# Altium schematic sheet 02_MCU_IO.SchDoc: =GlobalProjectName
size 594 x 420 mm; CheckedBy: A_D; Author: A_D; SheetNumber: 2; SheetTotal: 3; PageSetup: Record=PageOptions|CenterHorizontal=True|CenterVertical=True|PrintScale=0.70|XCorrection=1.00|YCorrection=1.00|PrintKind=2|BorderSize=5000000|LeftOffset=9000|BottomOffset=10100|Orientation=2|PaperLength=11176|PaperWidth=8636|Scale=100|PaperSource=259|PrintQuality=-3|MediaType=1|DitherType=10|PrintScaleMode=1|PaperKind=A3|PaperIndex=8
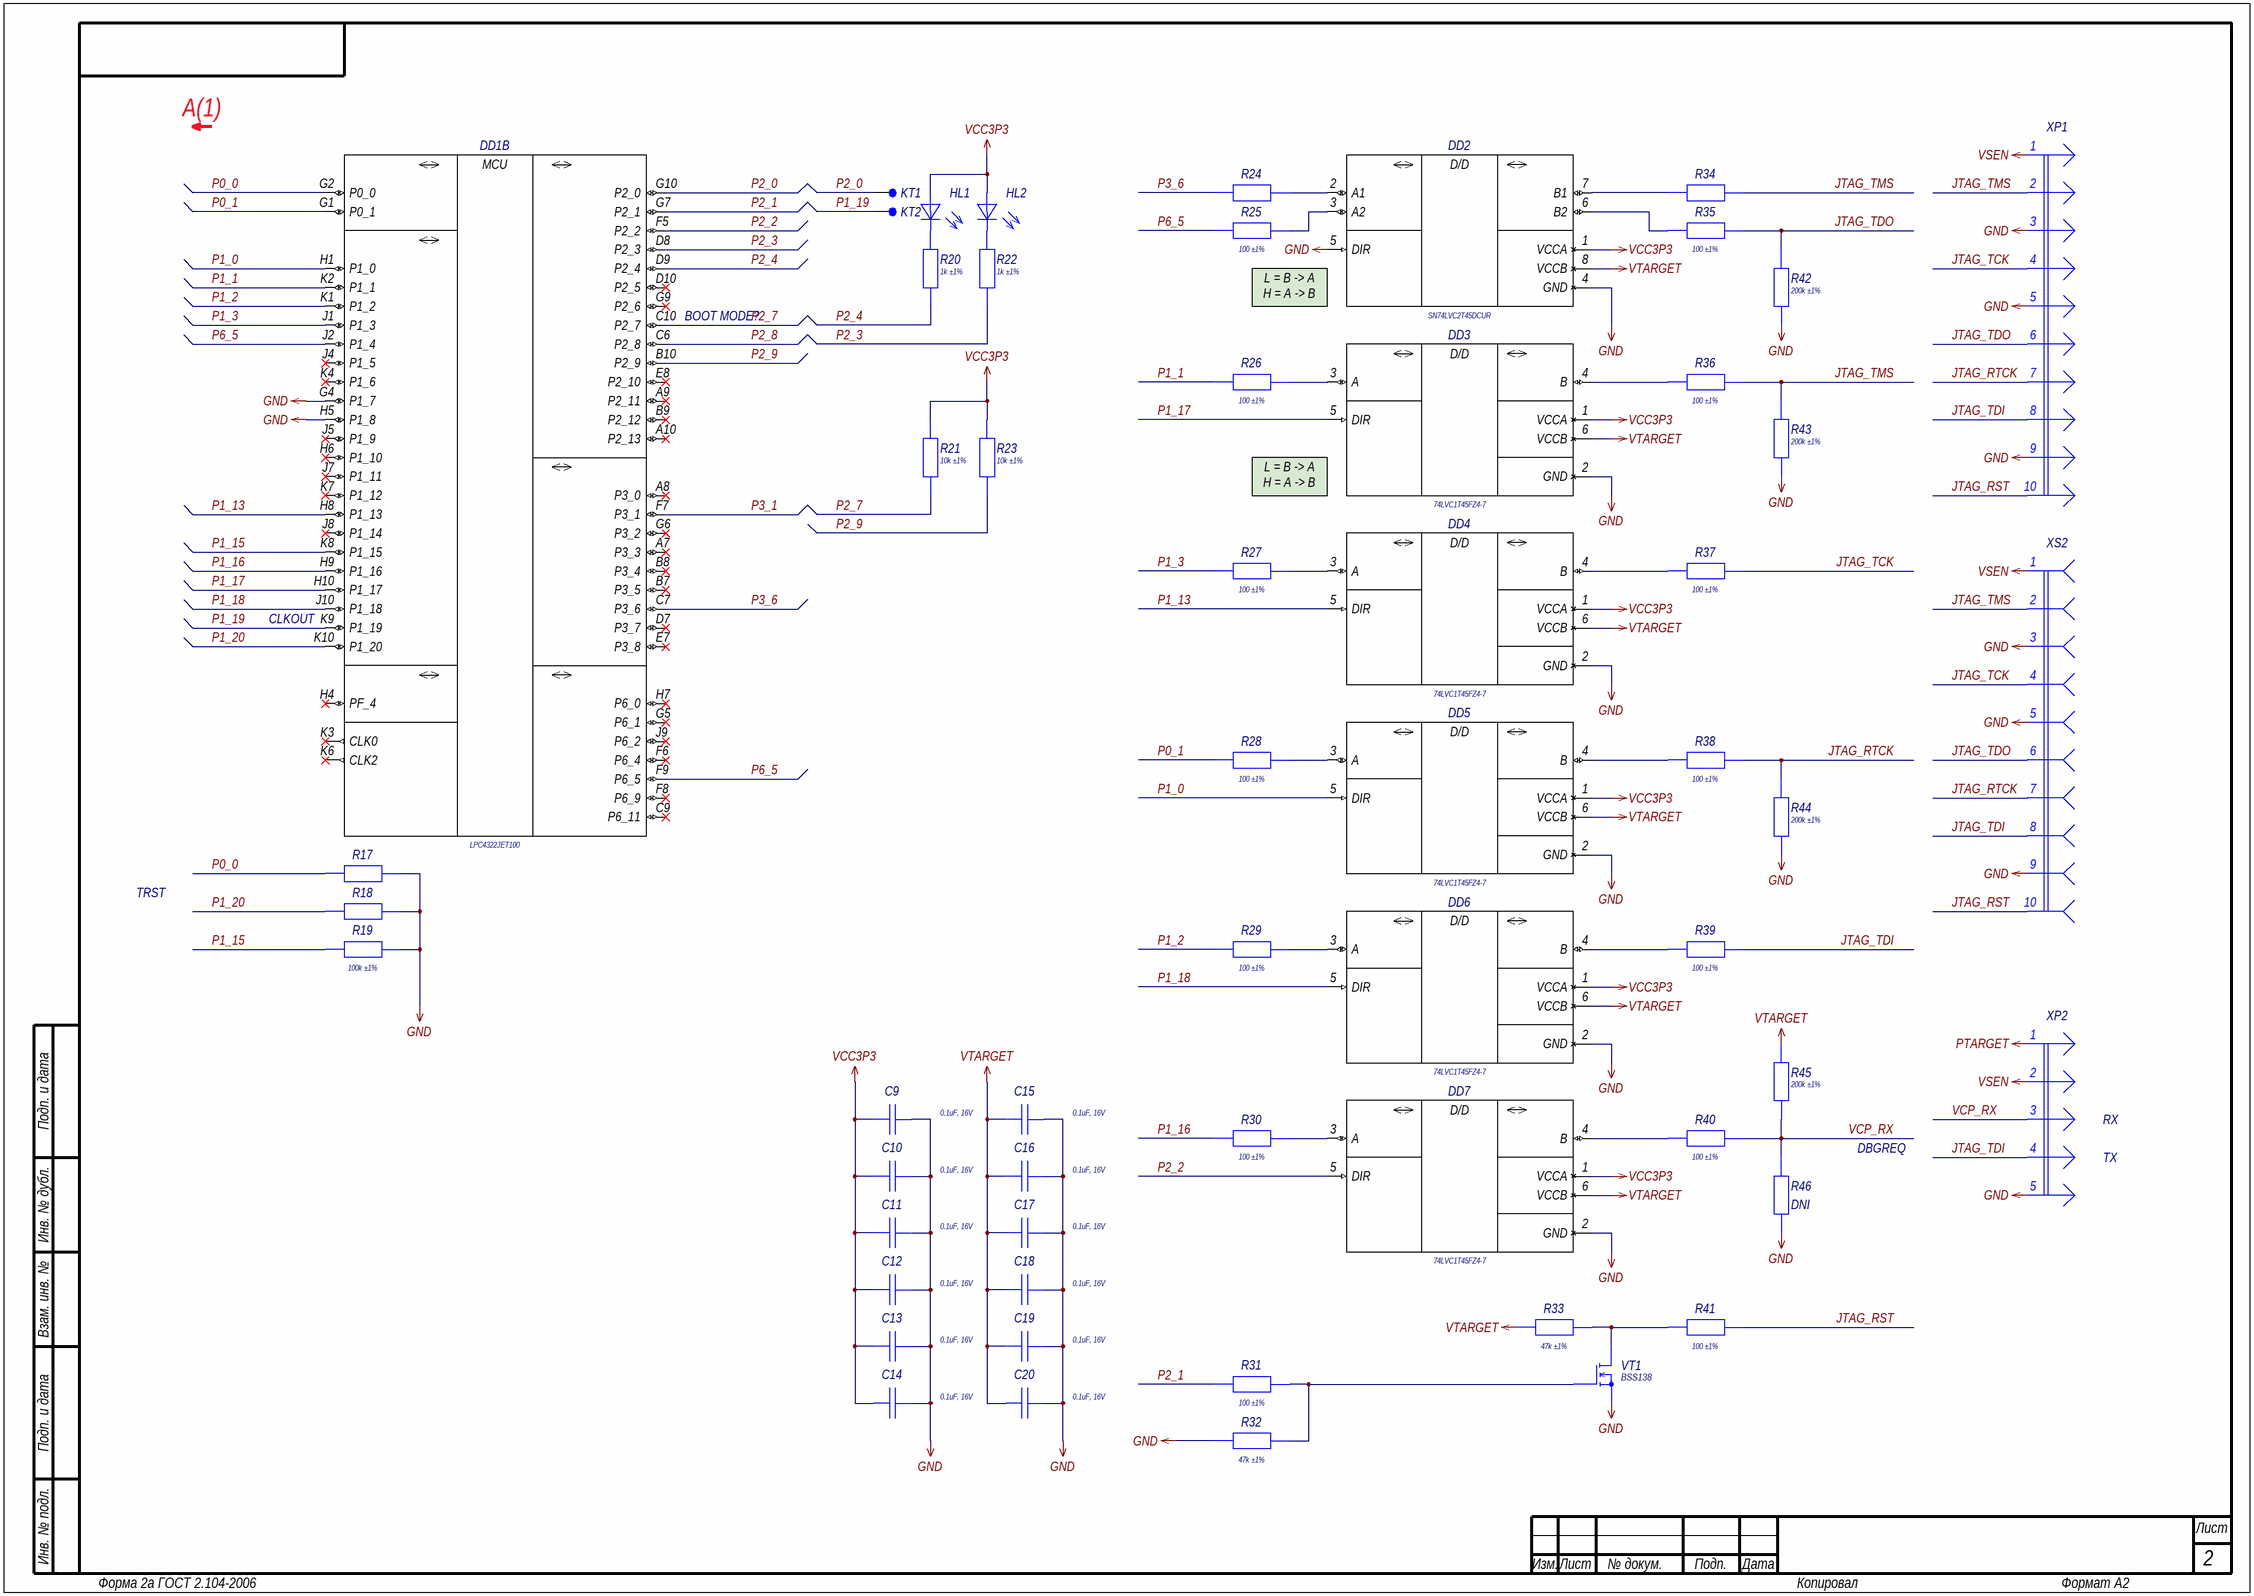
[diagram p0: 02_MCU_IO.SchDoc]

## Parts
C9  Schematic Value: 0.1uF, 16V  [C0402_100X050H050_H]  (hidden comment: Capacitor)
C10  Schematic Value: 0.1uF, 16V  [C0402_100X050H050_H]  (hidden comment: Capacitor)
C11  Schematic Value: 0.1uF, 16V  [C0402_100X050H050_H]  (hidden comment: Capacitor)
C12  Schematic Value: 0.1uF, 16V  [C0402_100X050H050_H]  (hidden comment: Capacitor)
C13  Schematic Value: 0.1uF, 16V  [C0402_100X050H050_H]  (hidden comment: Capacitor)
C14  Schematic Value: 0.1uF, 16V  [C0402_100X050H050_H]  (hidden comment: Capacitor)
C15  Schematic Value: 0.1uF, 16V  [C0402_100X050H050_H]  (hidden comment: Capacitor)
C16  Schematic Value: 0.1uF, 16V  [C0402_100X050H050_H]  (hidden comment: Capacitor)
C17  Schematic Value: 0.1uF, 16V  [C0402_100X050H050_H]  (hidden comment: Capacitor)
C18  Schematic Value: 0.1uF, 16V  [C0402_100X050H050_H]  (hidden comment: Capacitor)
C19  Schematic Value: 0.1uF, 16V  [C0402_100X050H050_H]  (hidden comment: Capacitor)
C20  Schematic Value: 0.1uF, 16V  [C0402_100X050H050_H]  (hidden comment: Capacitor)
DD1  Schematic Value: LPC4322JET100  [TFBGA-100_080P900X900X120_N]  (hidden comment: LPC43xxJET100-Series)  (part B of 3)
DD2  Schematic Value: SN74LVC2T45DCUR  [VSSOP-8_050P200X230X090_N]  (hidden comment: SN74LVC2T45DCx-Series)
DD3  Schematic Value: 74LVC1T45FZ4-7  [X2-DFN-6_050P140X100X040_N]  (hidden comment: 74LVC1T45x-Series)
DD4  Schematic Value: 74LVC1T45FZ4-7  [X2-DFN-6_050P140X100X040_N]  (hidden comment: 74LVC1T45x-Series)
DD5  Schematic Value: 74LVC1T45FZ4-7  [X2-DFN-6_050P140X100X040_N]  (hidden comment: 74LVC1T45x-Series)
DD6  Schematic Value: 74LVC1T45FZ4-7  [X2-DFN-6_050P140X100X040_N]  (hidden comment: 74LVC1T45x-Series)
DD7  Schematic Value: 74LVC1T45FZ4-7  [X2-DFN-6_050P140X100X040_N]  (hidden comment: 74LVC1T45x-Series)
HL1  Text  [LD0603_L]  (value not drawn)
HL2  Text  [LD0603_L]  (value not drawn)
KT1  Text  [TP-SMT-C-0.5mm]  (value not drawn)  (no BOM)
KT2  Text  [TP-SMT-C-0.5mm]  (value not drawn)  (no BOM)
R17  Resistor  [R0402_100X050H035_H]  (value not drawn)
R18  Resistor  [R0402_100X050H035_H]  (value not drawn)
R19  Schematic Value: 100k ±1%  [R0402_100X050H035_H]  (hidden comment: Resistor)
R20  Schematic Value: 1k ±1%  [R0402_100X050H035_H]  (hidden comment: Resistor)
R21  Schematic Value: 10k ±1%  [R0402_100X050H035_H]  (hidden comment: Resistor)
R22  Schematic Value: 1k ±1%  [R0402_100X050H035_H]  (hidden comment: Resistor)
R23  Schematic Value: 10k ±1%  [R0402_100X050H035_H]  (hidden comment: Resistor)
R24  Resistor  [R0402_100X050H035_H]  (value not drawn)
R25  Schematic Value: 100 ±1%  [R0402_100X050H035_H]  (hidden comment: Resistor)
R26  Schematic Value: 100 ±1%  [R0402_100X050H035_H]  (hidden comment: Resistor)
R27  Schematic Value: 100 ±1%  [R0402_100X050H035_H]  (hidden comment: Resistor)
R28  Schematic Value: 100 ±1%  [R0402_100X050H035_H]  (hidden comment: Resistor)
R29  Schematic Value: 100 ±1%  [R0402_100X050H035_H]  (hidden comment: Resistor)
R30  Schematic Value: 100 ±1%  [R0402_100X050H035_H]  (hidden comment: Resistor)
R31  Schematic Value: 100 ±1%  [R0402_100X050H035_H]  (hidden comment: Resistor)
R32  Schematic Value: 47k ±1%  [R0402_100X050H035_H]  (hidden comment: Resistor)
R33  Schematic Value: 47k ±1%  [R0402_100X050H035_H]  (hidden comment: Resistor)
R34  Resistor  [R0402_100X050H035_H]  (value not drawn)
R35  Schematic Value: 100 ±1%  [R0402_100X050H035_H]  (hidden comment: Resistor)
R36  Schematic Value: 100 ±1%  [R0402_100X050H035_H]  (hidden comment: Resistor)
R37  Schematic Value: 100 ±1%  [R0402_100X050H035_H]  (hidden comment: Resistor)
R38  Schematic Value: 100 ±1%  [R0402_100X050H035_H]  (hidden comment: Resistor)
R39  Schematic Value: 100 ±1%  [R0402_100X050H035_H]  (hidden comment: Resistor)
R40  Schematic Value: 100 ±1%  [R0402_100X050H035_H]  (hidden comment: Resistor)
R41  Schematic Value: 100 ±1%  [R0402_100X050H035_H]  (hidden comment: Resistor)
R42  Schematic Value: 200k ±1%  [R0402_100X050H035_H]  (hidden comment: Resistor)
R43  Schematic Value: 200k ±1%  [R0402_100X050H035_H]  (hidden comment: Resistor)
R44  Schematic Value: 200k ±1%  [R0402_100X050H035_H]  (hidden comment: Resistor)
R45  Schematic Value: 200k ±1%  [R0402_100X050H035_H]  (hidden comment: Resistor)
R46  Resistor  [R0402_100X050H035_H]  (value not drawn)  (no BOM)
VT1  Schematic Value: BSS138  [SOT-23_190P290X160X145_N]  (hidden comment: MOSFET-N_32)
XP1  Text  [IDC-10MR]  (value not drawn)
XP2  Text  [PLS-5RR]  (value not drawn)
XS2  Text  [XF2M-1015-1A]  (value not drawn)

## Nets
GND: C9.1 C10.1 C11.1 C12.1 C13.1 C14.1 C15.1 C16.1 C17.1 C18.1 C19.1 C20.1 DD1.G4(P1_7) DD1.H5(P1_8) DD2.4(GND) DD2.5(DIR) DD3.2(GND) DD4.2(GND) DD5.2(GND) DD6.2(GND) DD7.2(GND) R17.2 R18.2 R19.2 R32.2 R42.1 R43.1 R44.1 R46.1 VT1.2(S) XP1.3 XP1.5 XP1.9 XP2.5 XS2.3 XS2.5 XS2.9
PTARGET: XP2.1
VCC3P3: C9.2 C10.2 C11.2 C12.2 C13.2 C14.2 DD2.1(VCCA) DD3.1(VCCA) DD4.1(VCCA) DD5.1(VCCA) DD6.1(VCCA) DD7.1(VCCA) HL1.1 HL2.1 R21.1 R23.1
VSEN: XP1.1 XP2.2 XS2.1
VTARGET: C15.2 C16.2 C17.2 C18.2 C19.2 C20.2 DD2.8(VCCB) DD3.6(VCCB) DD4.6(VCCB) DD5.6(VCCB) DD6.6(VCCB) DD7.6(VCCB) R33.2 R45.2
JTAG_RST: R41.2 XP1.10 XS2.10
JTAG_RTCK: R38.2 R44.2 XP1.7 XS2.7
JTAG_TCK: R37.2 XP1.4 XS2.4
JTAG_TDI: R39.2 XP1.8 XP2.4 XS2.8
JTAG_TDO: R35.2 R42.2 XP1.6 XS2.6
JTAG_TMS: R34.2 R36.2 R43.2 XP1.2 XS2.2
P0_0: DD1.G2(P0_0) R17.1
P0_1: DD1.G1(P0_1) R28.1
P1_0: DD1.H1(P1_0) DD5.5(DIR)
P1_1: DD1.K2(P1_1) R26.1
P1_2: DD1.K1(P1_2) R29.1
P1_3: DD1.J1(P1_3) R27.1
P1_13: DD1.H8(P1_13) DD4.5(DIR)
P1_15: DD1.K8(P1_15) R19.1
P1_16: DD1.H9(P1_16) R30.1
P1_17: DD1.H10(P1_17) DD3.5(DIR)
P1_18: DD1.J10(P1_18) DD6.5(DIR)
P1_19: DD1.K9(P1_19) KT2.1
P1_20: DD1.K10(P1_20) R18.1
P2_0: DD1.G10(P2_0) KT1.1
P2_1: DD1.G7(P2_1) R31.1
P2_2: DD1.F5(P2_2) DD7.5(DIR)
P2_3: DD1.D8(P2_3) R22.1
P2_4: DD1.D9(P2_4) R20.1
P2_7: DD1.C10(P2_7) R21.2
P2_8: DD1.C6(P2_8)
P2_9: DD1.B10(P2_9) R23.2
P3_1: DD1.F7(P3_1)
P3_6: DD1.C7(P3_6) R24.1
P6_5: DD1.F9(P6_5) DD1.J2(P1_4) R25.1
VCP_RX: R40.2 R45.1 R46.2 XP2.3
NetDD2_2: DD2.2(A1) R24.2
NetDD2_3: DD2.3(A2) R25.2
NetDD2_6: DD2.6(B2) R35.1
NetDD2_7: DD2.7(B1) R34.1
NetDD3_3: DD3.3(A) R26.2
NetDD3_4: DD3.4(B) R36.1
NetDD4_3: DD4.3(A) R27.2
NetDD4_4: DD4.4(B) R37.1
NetDD5_3: DD5.3(A) R28.2
NetDD5_4: DD5.4(B) R38.1
NetDD6_3: DD6.3(A) R29.2
NetDD6_4: DD6.4(B) R39.1
NetDD7_3: DD7.3(A) R30.2
NetDD7_4: DD7.4(B) R40.1
NetHL1_2: HL1.2 R20.2
NetHL2_2: HL2.2 R22.2
NetR31_2: R31.2 R32.1 VT1.1(G)
NetR33_1: R33.1 R41.1 VT1.3(D)

Not connected (* = marked no-connect by the designer): DD1 A7(P3_3)* A8(P3_0)* A9(P2_11)* A10(P2_13)* B7(P3_5)* B8(P3_4)* B9(P2_12)* C9(P6_11)* D7(P3_7)* D10(P2_5)* E7(P3_8)* E8(P2_10)* F6(P6_4)* F8(P6_9)* G5(P6_1)* G6(P3_2)* G9(P2_6)* H4(PF_4)* H6(P1_10)* H7(P6_0)* J4(P1_5)* J5(P1_9)* J7(P1_11)* J8(P1_14)* J9(P6_2)* K3(CLK0)* K4(P1_6)* K6(CLK2)* K7(P1_12)*

## Notes on the sheet
- А(1)
- (near DD2) L = B -> A
  H = A -> B
- (near DD1) BOOT MODE?
- (near DD3) L = B -> A
  H = A -> B
- (near DD1) CLKOUT
- TRST
- RX
- DBGREQ
- TX
- (near R46) DNI
- Подп. и дата
- Инв. № дубл.
- Взам. инв. №
- Инв. № подл.
- Изм.
- Лист
- № докум.
- Подп.
- Дата
- Форма 2а ГОСТ 2.104-2006
- Копировал
- Формат А2
- (in symbol 74LVC1T45FZ4-7) D/D
- (in symbol LPC4322JET100, part B) MCU
- (in symbol SN74LVC2T45DCUR) D/D

## Library data of the parts
C9-C20 = GCM155R71C104KA55D: Manufacturer: Murata; ID: 163; Value: 0.1uF; Voltage: 16V; Tolerance: ±10%; Dielectric Type: X7R; Functional Analog: GRM155R71C104KA88D, GCM155R71C104KA55J, GCM155R71C104KA55W; AEC Standard: AEC-Q200; Part Number: GCM155R71C104KA55D; Footprint: 0402; LCSC Part: C85857; Temperature Min: -55°С; Temperature Max: +125°С; Part Type: Конденсатор
DD1 = LPC4322JET100: Manufacturer: NXP Semiconductors; ID: 45; Supply Operation: +2.4…3.6V; Prog Interface: JTAG, SWD, USB; Operation Frequency: 204MHz; ROM: 512K; RAM: 104K; IO Lines: 49; Part Number: LPC4322JET100; Value: LPC4322JET100; Temperature Min: -40°С; Temperature Max: +105°С
DD2 = SN74LVC2T45DCUR: Manufacturer: Texas Instruments; ID: 18; Supply 1 Operation: +1,65…5,5V; Supply Current: 10uA; Directional: Unidirection; Channels: 2; Max Data Rate: 420Mbps; Functional Analog: 74LVCH2T45DC,125; Part Number: SN74LVC2T45DCUR; Value: SN74LVC2T45DCUR; Supply 2 Operation: +1,65…5,5V; LCSC Part: C15741; Temperature Min: -40°С; Temperature Max: +85°С; Part Type: Микросхема
DD3-DD7 = 74LVC1T45FZ4-7: Manufacturer: Diodes Incorporated; ID: 13; Supply 1 Operation: +1.65…5.5V; Supply Current: 3uA; Directional: Bidirection; Channels: 1; Prop Delay: 15.1nS; Part Number: 74LVC1T45FZ4-7; Value: 74LVC1T45FZ4-7; Supply 2 Operation: +1.65…5.5V; LCSC Part: C150482; Temperature Min: -40°С; Temperature Max: +150°С; Part Type: Микросхема
HL1 = NCD0603R1: Manufacturer: Foshan NationStar Optoelectronics; Type: Индикатор единичный; ID: 42; Forward Voltage: 2.0V; Forward Current: 25mA; Power Dissipation: 65mW; Luminous Flux: 120; Color: Red; Leds: 1; Published: 03.12.2013; Publisher: Andrew Danich; Part Number: NCD0603R1; Value: NCD0603R1; Footprint: 0603; LCSC Part: C84263; Temperature Min: -30°С; Temperature Max: +85°С; Schematic Value: NCD0603R1
HL2 = NCD0603G1: Manufacturer: Foshan NationStar Optoelectronics; Type: Индикатор единичный; ID: 45; Forward Voltage: 3.0V; Forward Current: 20mA; Power Dissipation: 72mW; Luminous Flux: 650; Color: Green; Leds: 1; Published: 03.12.2013; Publisher: Andrew Danich; Part Number: NCD0603G1; Value: NCD0603G1; Footprint: 0603; LCSC Part: C84267; Temperature Min: -30°С; Temperature Max: +85°С; Schematic Value: NCD0603G1
KT1 KT2 = TestPoint-SMT: ID: 6; Application Type: On PCB Test Point; Published: 03.03.2015; Publisher: Andrew Danich; Part Number: TestPoint-SMT; Value: TestPoint-SMT; Schematic Value: TestPoint-SMT
R17 R18 = 0402WGF1003TCE: Manufacturer: Uniroyal Elec; ID: 661; Value: 100k; Limit Voltage: 50V; Tolerance: ±1%; Temperature Coefficient: 100ppm; Total Power Dissipation: 0.1W; Series Type: Thick-Film; Schematic Value: 100k ±1%; Part Number: 0402WGF1003TCE; Footprint: 0402; Temperature Min: -55°С; Temperature Max: +155°С; Part Type: Резистор; LCSC Part: C25741
R19 = 0402WGF1003TCE: Manufacturer: Uniroyal Elec; ID: 661; Value: 100k; Limit Voltage: 50V; Tolerance: ±1%; Temperature Coefficient: 100ppm; Total Power Dissipation: 0.1W; Series Type: Thick-Film; Part Number: 0402WGF1003TCE; Footprint: 0402; Temperature Min: -55°С; Temperature Max: +155°С; Part Type: Резистор; LCSC Part: C25741
R20 R22 = 0402WGF1001TCE: Manufacturer: Uniroyal Elec; ID: 663; Value: 1k; Limit Voltage: 50V; Tolerance: ±1%; Temperature Coefficient: 100ppm; Total Power Dissipation: 0.1W; Series Type: Thick-Film; Part Number: 0402WGF1001TCE; Footprint: 0402; Temperature Min: -55°С; Temperature Max: +155°С; Part Type: Резистор; LCSC Part: C11702
R21 R23 = 0402WGF1002TCE: Manufacturer: Uniroyal Elec; ID: 665; Value: 10k; Limit Voltage: 50V; Tolerance: ±1%; Temperature Coefficient: 100ppm; Total Power Dissipation: 0.1W; Series Type: Thick-Film; Part Number: 0402WGF1002TCE; Footprint: 0402; Temperature Min: -55°С; Temperature Max: +155°С; Part Type: Резистор; LCSC Part: C25744
R24 R34 = RC0402FR-07100RL: Manufacturer: Yageo; ID: 457; Value: 100; Limit Voltage: 50V; Tolerance: ±1%; Temperature Coefficient: 100ppm; Total Power Dissipation: 0.1W; Series Type: Thick-Film; Schematic Value: 100 ±1%; Part Number: RC0402FR-07100RL; Footprint: 0402; Temperature Min: -55°С; Temperature Max: +155°С; Part Type: Резистор
R25-R31 R35-R41 = RC0402FR-07100RL: Manufacturer: Yageo; ID: 457; Value: 100; Limit Voltage: 50V; Tolerance: ±1%; Temperature Coefficient: 100ppm; Total Power Dissipation: 0.1W; Series Type: Thick-Film; Part Number: RC0402FR-07100RL; Footprint: 0402; Temperature Min: -55°С; Temperature Max: +155°С; Part Type: Резистор
R32 R33 = 0402WGF4702TCE: Manufacturer: Uniroyal Elec; ID: 668; Value: 47k; Limit Voltage: 50V; Tolerance: ±1%; Temperature Coefficient: 100ppm; Total Power Dissipation: 0.1W; Series Type: Thick-Film; Part Number: 0402WGF4702TCE; Footprint: 0402; Temperature Min: -55°С; Temperature Max: +155°С; Part Type: Резистор; LCSC Part: C25792
R42-R45 = 0402WGF2003TCE: Manufacturer: Uniroyal Elec; ID: 676; Value: 200k; Limit Voltage: 50V; Tolerance: ±1%; Temperature Coefficient: 100ppm; Total Power Dissipation: 0.1W; Series Type: Thick-Film; Part Number: 0402WGF2003TCE; Footprint: 0402; Temperature Min: -55°С; Temperature Max: +155°С; Part Type: Резистор; LCSC Part: C25764
R46 = 0402WGF2003TCE: Manufacturer: Uniroyal Elec; ID: 676; Value: 200k; Limit Voltage: 50V; Tolerance: ±1%; Temperature Coefficient: 100ppm; Total Power Dissipation: 0.1W; Series Type: Thick-Film; Schematic Value: 200k ±1%; Part Number: 0402WGF2003TCE; Footprint: 0402; Temperature Min: -55°С; Temperature Max: +155°С; Part Type: Резистор; LCSC Part: C25764
VT1 = BSS138: Type: Транзистор; ID: 58; Value: BSS138; D-S Voltage: 50V; Drain Current: 220mA; D-S On-Resistance: 6omh; Gate Capacitance: 27pF; Total Power Dissipation: 350mW; Gate Threshold Voltage: 1.5V; Published: 24.09.2010; Publisher: Andrew Danich; Part Number: BSS138; Temperature Min: -55°С; Temperature Max: +150°С; Part Type: Транзистор
XP1 = IDC-10MR: ID: 11; Limit Voltage: 500V; Limit Current: 1A; Connector Type: Male; Resistance: 20mohm; Pitch: 2.54mm; Functional Analog: DS1013-10RSIB, C3510-10SPGB00; Part Number: IDC-10MR; Value: IDC-10MR; Pins: 10; Schematic Value: IDC-10MR
XP2 = PLS-5R: Part Number: PLS-5R; ID: 32; Value: PLS-5R; Limit Voltage: 250V; Limit Current: 3A; Connector Type: Male; Resistance: 15momh; Surface Finish: Gold; Pitch: 2.54mm; Pins: 5; Schematic Value: PLS-5R
XS2 = XF2M-1015-1A: Manufacturer: Omron Electronics; ID: 7; Limit Voltage: 50V; Limit Current: 500mA; Connector Type: Female; Resistance: 0.05ohm; Pitch: 0.5mm; Functional Analog: AFC24-S10FIA-00; Part Number: XF2M-1015-1A; Value: XF2M-1015-1A; Pins: 10; Series: FPC; Temperature Min: -30°С; Temperature Max: +85°С; Schematic Value: XF2M-1015-1A